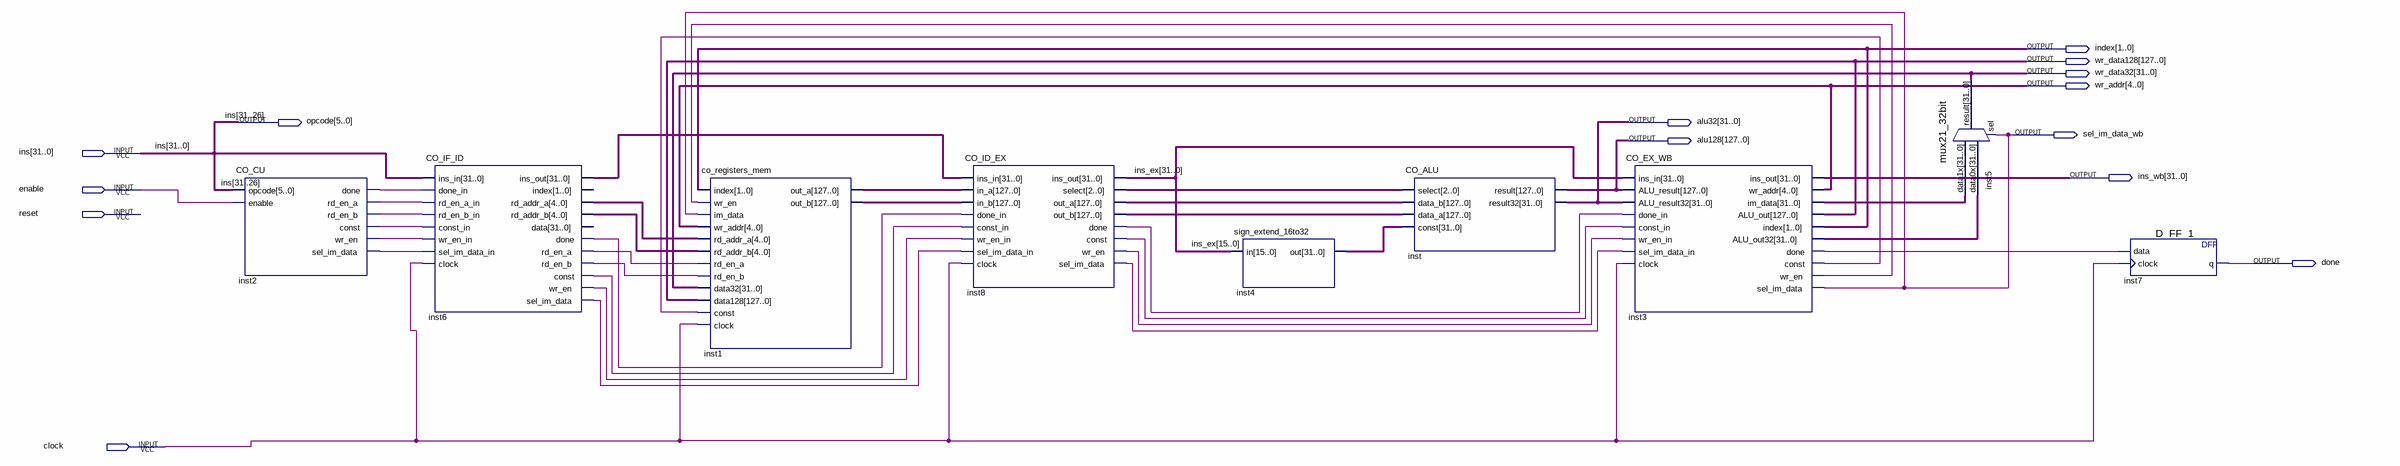
[diagram p0: schematic sheet]
// Quartus schematic CO.bdf as structural Verilog: 9 symbols, 14 pins
module CO (
  input  [31:0] ins,
  input  enable,
  input  reset,
  input  clock,
  output [1:0] index,
  output [127:0] wr_data128,
  output [31:0] wr_data32,
  output [4:0] wr_addr,
  output [5:0] opcode,
  output [31:0] alu32,
  output sel_im_data_wb,
  output [127:0] alu128,
  output [31:0] ins_wb,
  output done
);

  wire inst2_const, inst2_done, inst2_rd_en_a, inst2_rd_en_b, inst2_sel_im_data, inst2_wr_en, inst3_const,
       inst3_done, inst3_wr_en, inst6_const, inst6_done, inst6_rd_en_a, inst6_rd_en_b, inst6_sel_im_data,
       inst6_wr_en, inst8_const, inst8_done, inst8_sel_im_data, inst8_wr_en;
  wire [2:0] inst8_select;
  wire [4:0] inst6_rd_addr_a, inst6_rd_addr_b;
  wire [31:0] ins_ex, inst3_alu_out32, inst3_im_data, inst4_out, inst6_ins_out;
  wire [127:0] inst1_out_a, inst1_out_b, inst8_out_a, inst8_out_b;

  CO_CU inst2 (
    .opcode(ins[31:26]), .enable(enable), .done(inst2_done), .rd_en_a(inst2_rd_en_a),
    .rd_en_b(inst2_rd_en_b), .\const (inst2_const), .wr_en(inst2_wr_en), .sel_im_data(inst2_sel_im_data));
  CO_IF_ID inst6 (
    .ins_in(ins), .done_in(inst2_done), .rd_en_a_in(inst2_rd_en_a), .rd_en_b_in(inst2_rd_en_b),
    .const_in(inst2_const), .wr_en_in(inst2_wr_en), .sel_im_data_in(inst2_sel_im_data), .clock(clock),
    .ins_out(inst6_ins_out), .rd_addr_a(inst6_rd_addr_a), .rd_addr_b(inst6_rd_addr_b), .done(inst6_done),
    .rd_en_a(inst6_rd_en_a), .rd_en_b(inst6_rd_en_b), .\const (inst6_const), .wr_en(inst6_wr_en),
    .sel_im_data(inst6_sel_im_data));  // open: index, data
  co_registers_mem inst1 (
    .index(index), .wr_en(inst3_wr_en), .im_data(sel_im_data_wb), .wr_addr(wr_addr),
    .rd_addr_a(inst6_rd_addr_a), .rd_addr_b(inst6_rd_addr_b), .rd_en_a(inst6_rd_en_a),
    .rd_en_b(inst6_rd_en_b), .data32(wr_data32), .data128(wr_data128), .\const (inst3_const), .clock(clock),
    .out_a(inst1_out_a), .out_b(inst1_out_b));
  CO_ID_EX inst8 (
    .ins_in(inst6_ins_out), .in_a(inst1_out_a), .in_b(inst1_out_b), .done_in(inst6_done),
    .const_in(inst6_const), .wr_en_in(inst6_wr_en), .sel_im_data_in(inst6_sel_im_data), .clock(clock),
    .ins_out(ins_ex), .select(inst8_select), .out_a(inst8_out_a), .out_b(inst8_out_b), .done(inst8_done),
    .\const (inst8_const), .wr_en(inst8_wr_en), .sel_im_data(inst8_sel_im_data));
  sign_extend_16to32 inst4 (.in(ins_ex[15:0]), .out(inst4_out));
  CO_ALU inst (
    .select(inst8_select), .data_b(inst8_out_a), .data_a(inst8_out_b), .\const (inst4_out), .result(alu128),
    .result32(alu32));
  CO_EX_WB inst3 (
    .ins_in(ins_ex), .ALU_result(alu128), .ALU_result32(alu32), .done_in(inst8_done), .const_in(inst8_const),
    .wr_en_in(inst8_wr_en), .sel_im_data_in(inst8_sel_im_data), .clock(clock), .ins_out(ins_wb),
    .wr_addr(wr_addr), .im_data(inst3_im_data), .ALU_out(wr_data128), .index(index),
    .ALU_out32(inst3_alu_out32), .done(inst3_done), .\const (inst3_const), .wr_en(inst3_wr_en),
    .sel_im_data(sel_im_data_wb));
  mux21_32bit inst5 (.data1x(inst3_im_data), .data0x(inst3_alu_out32), .sel(sel_im_data_wb), .result(wr_data32));
  D_FF_1 inst7 (.data(inst3_done), .clock(clock), .q(done));

  assign opcode = ins[31:26];
endmodule
